# Altium project Apollo_Main_board.PrjPcb
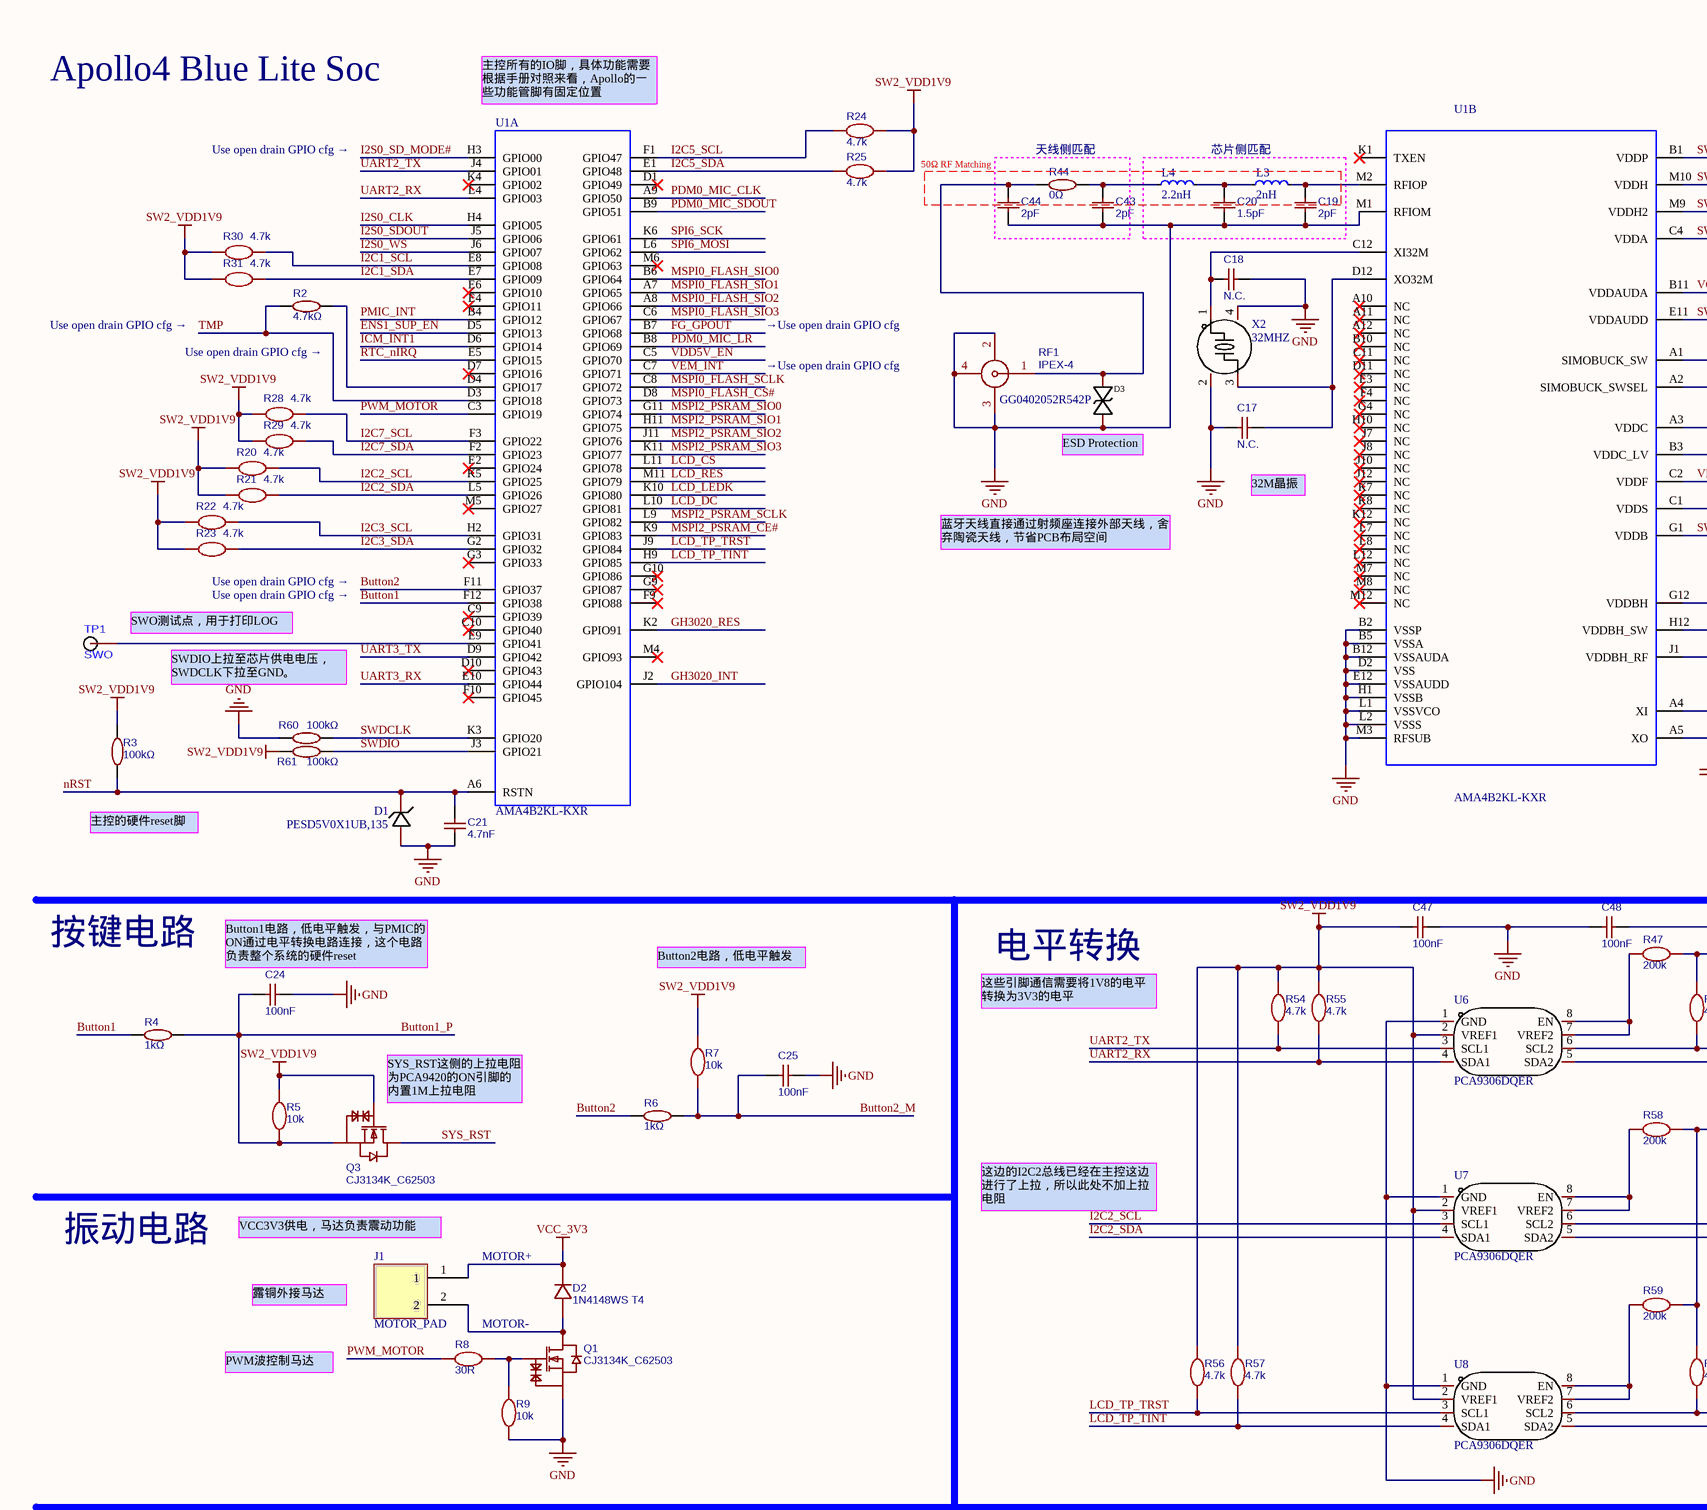
[diagram p0: Apollo_Main_Board.SchDoc, top left]
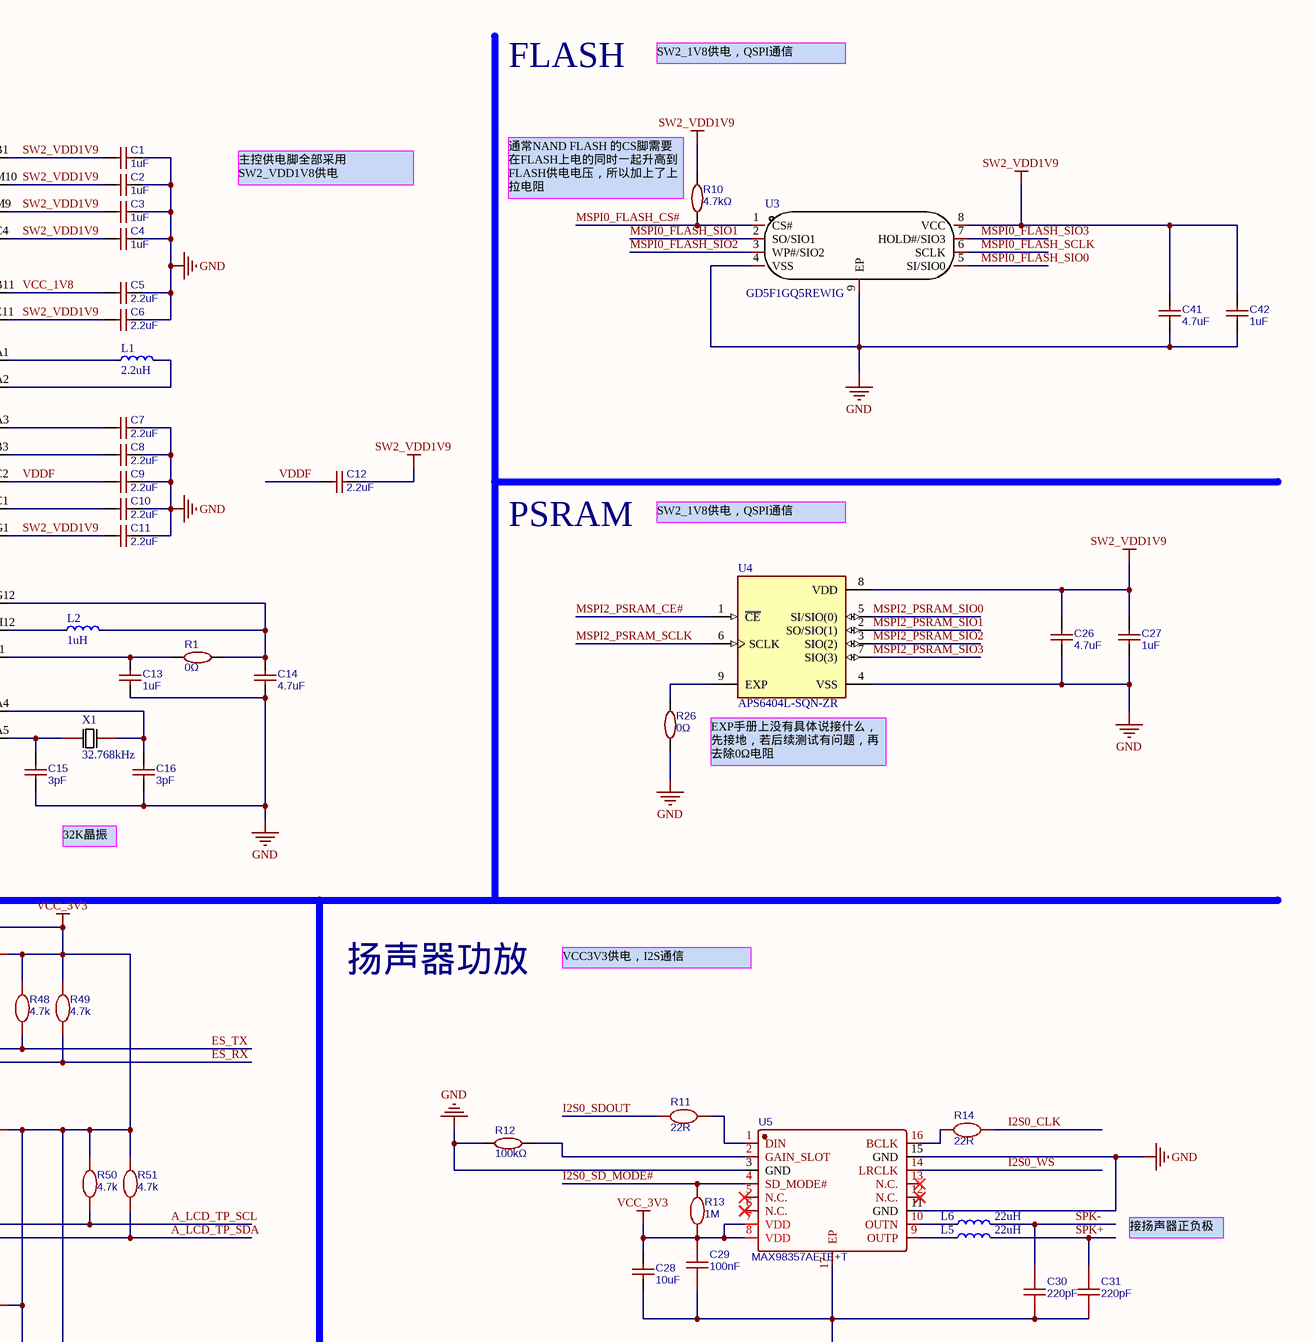
[diagram p1: Apollo_Main_Board.SchDoc, top right]
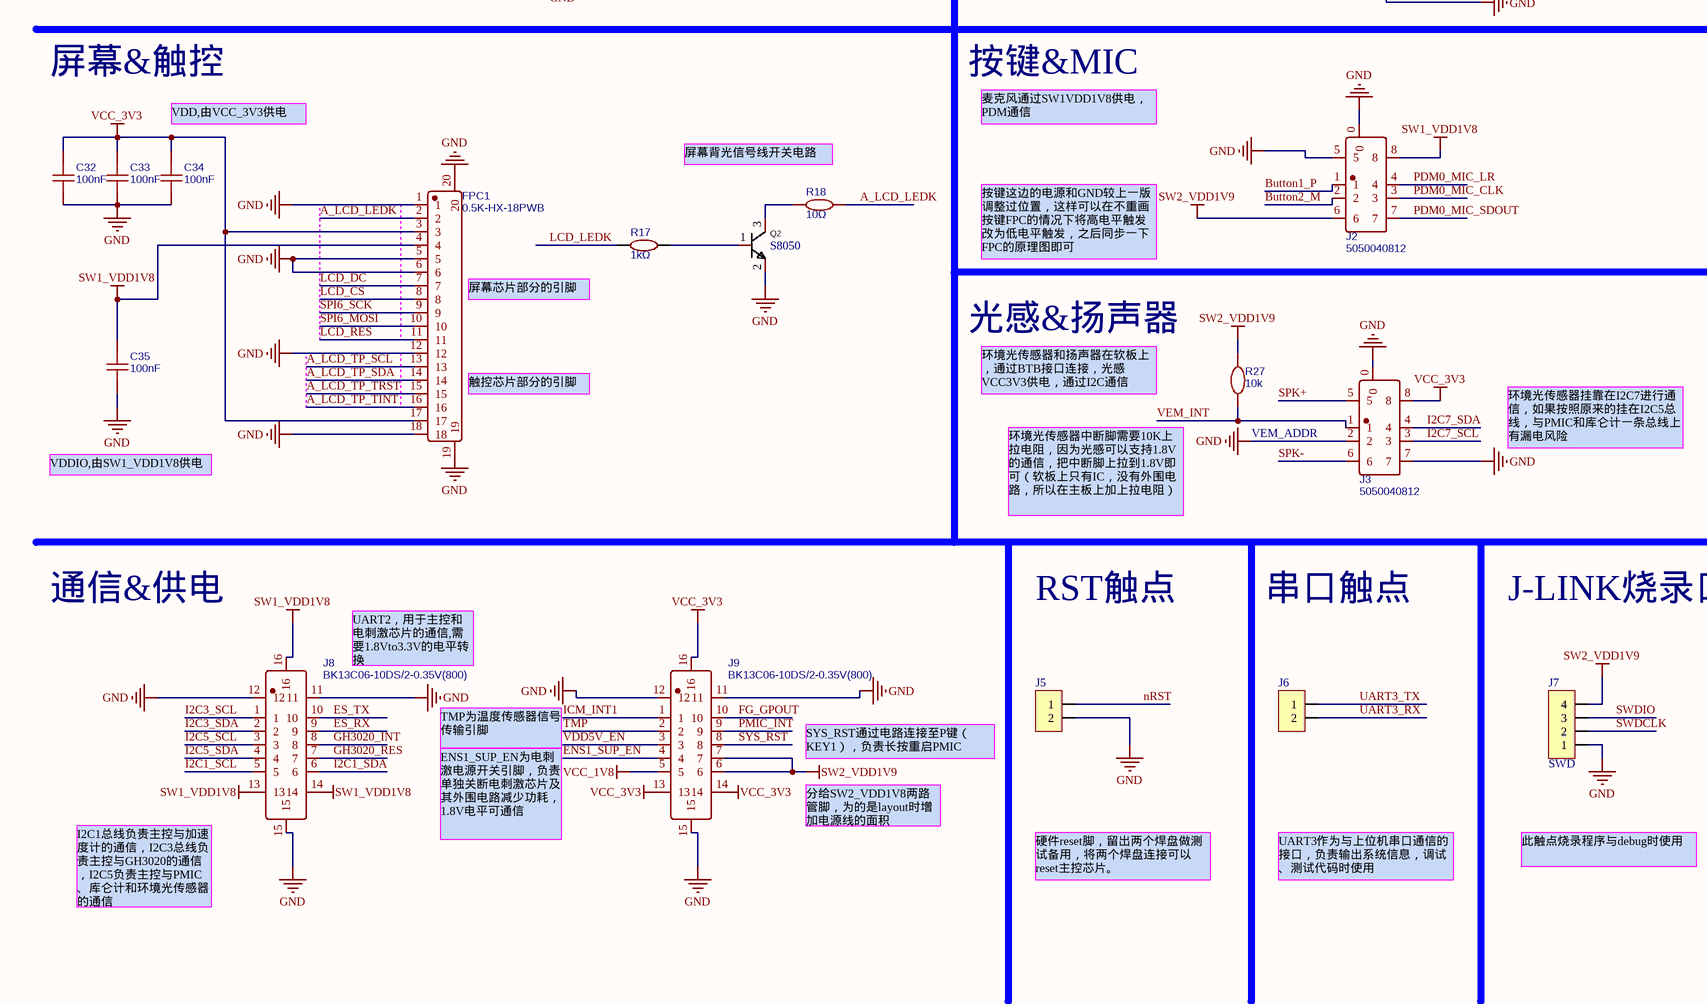
[diagram p2: Apollo_Main_Board.SchDoc, bottom left]
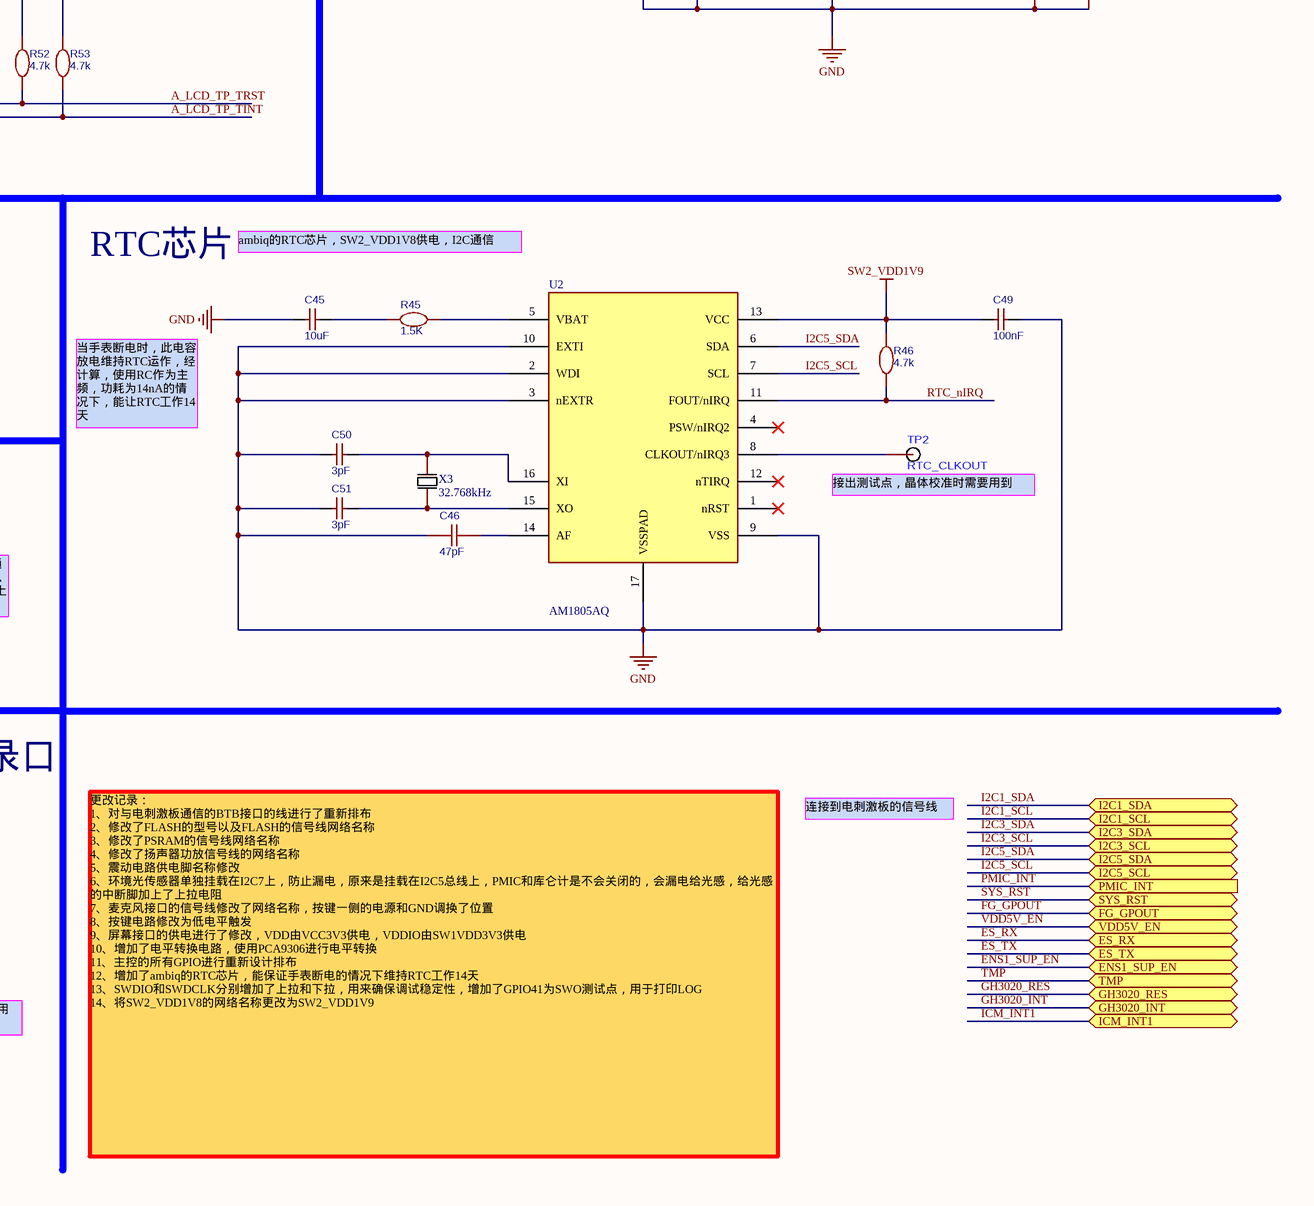
[diagram p3: Apollo_Main_Board.SchDoc, bottom right]
1 sheet, 125 parts. Net scope: flat (ports and power ports of the same name join across sheets).
Board files: Apollo_Main_Board_1 8.PcbDoc, Apollo_Main_Board_exercise.PcbDoc

## Sheet Apollo_Main_Board.SchDoc
size 558 x 469 mm; SheetNumber: 1; SheetTotal: 1

### Parts
C1  1uF  [C0201]
C2  1uF  [C0201]
C3  1uF  [C0201]
C4  1uF  [C0201]
C5  2.2uF  [C0201]
C6  2.2uF  [C0201]
C7  2.2uF  [C0201]
C8  2.2uF  [C0201]
C9  2.2uF  [C0201]
C10  2.2uF  [C0201]
C11  2.2uF  [C0201]
C12  2.2uF  [C0201]
C13  1uF  [C0201]
C14  4.7uF  [C0201]
C15  3pF  [C0201]
C16  3pF  [C0201]
C17  N.C.  [C0201]
C18  N.C.  [C0201]
C19  2pF  [C0201]
C20  1.5pF  [C0201]
C21  4.7nF  [C0201]
C24  100nF  [C0201]
C25  100nF  [C0201]
C26  4.7uF  [C0201]
C27  1uF  [C0201]
C28  10uF  [C0402]
C29  100nF  [C0201]
C30  220pF  [C0201]
C31  220pF  [C0201]
C32  100nF  [C0201]
C33  100nF  [C0201]
C34  100nF  [C0201]
C35  100nF  [C0201]
C41  4.7uF  [C0201]
C42  1uF  [C0201]
C43  2pF  [C0201]
C44  2pF  [C0201]
C45  10uF  [C0402]
C46  47pF  [C0201]
C47  100nF  [C0201]
C48  100nF  [C0201]
C49  100nF  [C0201]
C50  3pF  [C0201]
C51  3pF  [C0201]
D1  PESD5V0X1UB,135  [SOD-523_L1.2-W0.8-LS1.6-RD]
D2  1N4148WS T4  [SOD-323_L1.8-W1.3-LS2.5-RD]
D3  GG0402052R542P  [0402]
FPC1  0.5K-HX-18PWB  [FPC-SMD_18P-P0.50_HDGC_0.5K-HX-18PWB]
J1  MOTOR_PAD  [MOTOR_PAD]
J2  5050040812  [CONN-SMD_4P-P0.40_5050040812]
J3  5050040812  [CONN-SMD_4P-P0.40_5050040812]
J5  (no value)  [2PIN_1.27mm]
J6  (no value)  [2PIN_1.27mm]
J7  SWD  [4PIN_1.27mm]
J8  BK13C06-10DS/2-0.35V(800)  [CONN-SMD_BK13C06-10DS-2-0.35V-800]
J9  BK13C06-10DS/2-0.35V(800)  [CONN-SMD_BK13C06-10DS-2-0.35V-800]
L1  2.2uH  [C0603]
L2  1uH  [C0603]
L3  2nH  [C0201]
L4  2.2nH  [C0201]
L5  22uH  [0603A]
L6  22uH  [0603A]
Q1  CJ3134K_C62503  [SOT-723_L1.2-W0.8-P0.40-LS1.2-BR]
Q2  S8050  [SOT-23]
Q3  CJ3134K_C62503  [SOT-723_L1.2-W0.8-P0.40-LS1.2-BR]
R1  0Ω  [RES0201]
R2  4.7kΩ  [RES0201]
R3  100kΩ  [RES0201]
R4  1kΩ  [RES0201]
R5  10k  [RES0201]
R6  1kΩ  [RES0201]
R7  10k  [RES0201]
R8  30R  [RES0201]
R9  10k  [RES0201]
R10  4.7kΩ  [RES0201]
R11  22R  [RES0201]
R12  100kΩ  [RES0201]
R13  1M  [RES0201]
R14  22R  [RES0201]
R17  1kΩ  [RES0201]
R18  10Ω  [RES0201]
R20  4.7k  [RES0201]
R21  4.7k  [RES0201]
R22  4.7k  [RES0201]
R23  4.7k  [RES0201]
R24  4.7k  [RES0201]
R25  4.7k  [RES0201]
R26  0Ω  [RES0201]
R27  10k  [RES0201]
R28  4.7k  [RES0201]
R29  4.7k  [RES0201]
R30  4.7k  [RES0201]
R31  4.7k  [RES0201]
R44  0Ω  [RES0201]
R45  1.5K  [RES0201]
R46  4.7k  [RES0201]
R47  200k  [RES0201]
R48  4.7k  [RES0201]
R49  4.7k  [RES0201]
R50  4.7k  [RES0201]
R51  4.7k  [RES0201]
R52  4.7k  [RES0201]
R53  4.7k  [RES0201]
R54  4.7k  [RES0201]
R55  4.7k  [RES0201]
R56  4.7k  [RES0201]
R57  4.7k  [RES0201]
R58  200k  [RES0201]
R59  200k  [RES0201]
R60  100kΩ  [RES0201]
R61  100kΩ  [RES0201]
RF1  IPEX-4  [IPEX-SMD_4P-L1.8-W1.7-LS2.0]
TP1  SWO  [Testpoint]
TP2  RTC_CLKOUT  [Testpoint]
U1  AMA4B2KL-KXR  [BGA131_0P35_4P7x4P7_AP4BL]  (parts A,B of 2)
U2  AM1805AQ  [QFN50P300X300X90-17N]
U3  GD5F1GQ5REWIG  [WSON-8_L6.0-W5.0-P1.27-BL-EP]
U4  APS6404L-SQN-ZR  [PSON50P200X300X50-9N]
U5  MAX98357AETE+T  [TQFN-16_L3.0-W3.0-P0.50-BL-EP1.5]
U6  PCA9306DQER  [X2SON-8_L1.4-W1.0-P0.35-BL]
U7  PCA9306DQER  [X2SON-8_L1.4-W1.0-P0.35-BL]
U8  PCA9306DQER  [X2SON-8_L1.4-W1.0-P0.35-BL]
X1  32.768kHz  [OSC-SMD_2P-L1.6-W1.0]
X2  32MHZ  [CRYSTAL-SMD_4P-L1.6-W1.2-BL]
X3  32.768kHz  [OSC-SMD_2P-L1.6-W1.0]

### Blocks framed on the sheet
天线侧匹配: C43 C44 R44
芯片侧匹配: C19 C20 L3 L4

### Ports
ENS1_SUP_EN (bidir), ES_RX (bidir), ES_TX (bidir), FG_GPOUT (bidir), GH3020_INT (bidir), GH3020_RES (bidir), I2C1_SCL (bidir), I2C1_SDA (bidir), I2C3_SCL (bidir), I2C3_SDA (bidir), I2C5_SCL (bidir), I2C5_SDA (bidir), ICM_INT1 (bidir), PMIC_INT (in), SYS_RST (bidir), TMP (bidir), VDD5V_EN (bidir)

### Nets
GND: C1.1 C2.1 C3.1 C4.1 C5.1 C6.1 C7.1 C8.1 C9.1 C10.1 C11.1 C13.2 C14.2 C15.2 C16.2 C17.1 C18.2 C19.2 C20.2 C21.2 C24.2 C25.2 C26.2 C27.2 C28.2 C29.2 C30.1 C31.1 C32.2 C33.2 C34.2 C35.2 C41.2 C42.2 C43.2 C44.2 C45.2 C46.2 C47.1 C48.1 C49.2 C50.2 C51.2 D1.2(A) D3.1 FPC1.1 FPC1.5 FPC1.6 FPC1.12 FPC1.18 FPC1.19 FPC1.20 J2.0 J2.5 J3.0 J3.2 J3.7 J5.2 J7.1 J8.11 J8.12 J8.15 J9.11 J9.12 J9.15 Q1.2(S) Q2.2(E) R9.2 R12.2 R26.1 R60.2 RF1.2 RF1.3 RF1.4 U1.B2(VSSP) U1.B5(VSSA) U1.B12(VSSAUDA) U1.D2(VSS) U1.E12(VSSAUDD) U1.H1(VSSB) U1.L1(VSSVCO) U1.L2(VSSS) U1.M1(RFIOM) U1.M3(RFSUB) U2.2(WDI) U2.3(nEXTR) U2.9(VSS) U2.10(EXTI) U2.17(VSSPAD) U3.4(VSS) U3.9(EP) U4.4(VSS) U5.3(GND) U5.11(GND) U5.15(GND) U5.17(EP) U6.1(GND) U7.1(GND) U8.1(GND) X2.2(GND) X2.4(GND)
SW1_VDD1V8: C35.1 FPC1.4 J2.8 J8.13 J8.14 J8.16
SW2_VDD1V9: C1.2 C2.2 C3.2 C4.2 C6.2 C11.2 C12.1 C26.1 C27.1 C41.1 C42.1 C47.2 C49.1 J2.6 J7.4 J9.6 J9.7 Q3.1(G) R3.2 R5.1 R7.1 R10.2 R20.2 R21.2 R22.2 R23.2 R24.2 R25.2 R27.1 R28.2 R29.2 R30.2 R31.2 R46.2 R54.1 R55.1 R56.1 R57.1 R61.1 U1.B1(VDDP) U1.C4(VDDA) U1.E11(VDDAUDD) U1.G1(VDDB) U1.M9(VDDH2) U1.M10(VDDH) U2.13(VCC) U3.8(VCC) U4.8(VDD) U6.2(VREF1) U7.2(VREF1) U8.2(VREF1)
VCC_1V8: C5.2 J9.5 U1.B11(VDDAUDA)
VCC_3V3: C28.1 C29.1 C32.1 C33.1 C34.1 C48.2 D2.1(K) FPC1.3 FPC1.17 J1.1 J3.8 J9.13 J9.14 J9.16 R13.2 R47.2 R48.1 R49.1 R50.1 R51.1 R52.1 R53.1 R58.2 R59.2 U5.7(VDD) U5.8(VDD)
A_LCD_LEDK: FPC1.2 R18.2
A_LCD_TP_SCL: FPC1.13 R50.2 U7.6(SCL2)
A_LCD_TP_SDA: FPC1.14 R51.2 U7.5(SDA2)
A_LCD_TP_TINT: FPC1.16 R53.2 U8.5(SDA2)
A_LCD_TP_TRST: FPC1.15 R52.2 U8.6(SCL2)
Button1: R4.1 U1.F12(GPIO38)
Button1_P: C24.1 J2.1 Q3.2(S) R4.2 R5.2
Button2: R6.1 U1.F11(GPIO37)
Button2_M: C25.1 J2.2 R6.2 R7.2
ENS1_SUP_EN: J9.4 U1.D5(GPIO13) ; port ENS1_SUP_EN
ES_RX: J8.9 R49.2 U6.5(SDA2) ; port ES_RX
ES_TX: J8.10 R48.2 U6.6(SCL2) ; port ES_TX
FG_GPOUT: J9.10 U1.B7(GPIO68) ; port FG_GPOUT
GH3020_INT: J8.8 U1.J2(GPIO104) ; port GH3020_INT
GH3020_RES: J8.7 U1.K2(GPIO91) ; port GH3020_RES
I2C1_SCL: J8.5 R30.1 U1.E8(GPIO08) ; port I2C1_SCL
I2C1_SDA: J8.6 R31.1 U1.E7(GPIO09) ; port I2C1_SDA
I2C2_SCL: R20.1 U1.K5(GPIO25) U7.3(SCL1)
I2C2_SDA: R21.1 U1.L5(GPIO26) U7.4(SDA1)
I2C3_SCL: J8.1 R22.1 U1.H2(GPIO31) ; port I2C3_SCL
I2C3_SDA: J8.2 R23.1 U1.G2(GPIO32) ; port I2C3_SDA
I2C5_SCL: J8.3 R24.1 U1.F1(GPIO47) U2.7(SCL) ; port I2C5_SCL
I2C5_SDA: J8.4 R25.1 U1.E1(GPIO48) U2.6(SDA) ; port I2C5_SDA
I2C7_SCL: J3.3 R28.1 U1.F3(GPIO22)
I2C7_SDA: J3.4 R29.1 U1.F2(GPIO23)
I2S0_CLK: R14.1 U1.H4(GPIO05)
I2S0_SD_MODE#: R13.1 U1.H3(GPIO00) U5.4(SD_MODE#)
I2S0_SDOUT: R11.2 U1.J5(GPIO06)
I2S0_WS: U1.J6(GPIO07) U5.14(LRCLK)
ICM_INT1: J9.1 U1.D6(GPIO14) ; port ICM_INT1
LCD_CS: FPC1.8 U1.L11(GPIO78)
LCD_DC: FPC1.7 U1.L10(GPIO81)
LCD_LEDK: R17.1 U1.K10(GPIO80)
LCD_RES: FPC1.11 U1.M11(GPIO79)
LCD_TP_TINT: R57.2 U1.H9(GPIO85) U8.4(SDA1)
LCD_TP_TRST: R56.2 U1.J9(GPIO84) U8.3(SCL1)
MSPI0_FLASH_CS#: R10.1 U1.D8(GPIO73) U3.1(CS#)
MSPI0_FLASH_SCLK: U1.C8(GPIO72) U3.6(SCLK)
MSPI0_FLASH_SIO0: U1.B6(GPIO64) U3.5(SI/SIO0)
MSPI0_FLASH_SIO1: U1.A7(GPIO65) U3.2(SO/SIO1)
MSPI0_FLASH_SIO2: U1.A8(GPIO66) U3.3(WP#/SIO2)
MSPI0_FLASH_SIO3: U1.C6(GPIO67) U3.7(HOLD#/SIO3)
MSPI2_PSRAM_CE#: U1.K9(GPIO83) U4.1(~{CE})
MSPI2_PSRAM_SCLK: U1.L9(GPIO82) U4.6(SCLK)
MSPI2_PSRAM_SIO0: U1.G11(GPIO74) U4.5(SI/SIO(0))
MSPI2_PSRAM_SIO1: U1.H11(GPIO75) U4.2(SO/SIO(1))
MSPI2_PSRAM_SIO2: U1.J11(GPIO76) U4.3(SIO(2))
MSPI2_PSRAM_SIO3: U1.K11(GPIO77) U4.7(SIO(3))
nRST: C21.1 D1.1(C) J5.1 R3.1 U1.A6(RSTN)
PDM0_MIC_CLK: J2.3 U1.A9(GPIO50)
PDM0_MIC_LR: J2.4 U1.B8(GPIO69)
PDM0_MIC_SDOUT: J2.7 U1.B9(GPIO51)
PMIC_INT: J9.9 U1.B4(GPIO12) ; port PMIC_INT
PWM_MOTOR: R8.2 U1.C3(GPIO19)
RTC_nIRQ: R46.1 U1.E5(GPIO15) U2.11(FOUT/nIRQ)
SPI6_MOSI: FPC1.10 U1.L6(GPIO62)
SPI6_SCK: FPC1.9 U1.K6(GPIO61)
SPK+: C31.2 J3.5 L5.2
SPK-: C30.2 J3.6 L6.2
SWDCLK: J7.2 R60.1 U1.K3(GPIO20)
SWDIO: J7.3 R61.2 U1.J3(GPIO21)
SYS_RST: J9.8 Q3.3(D) ; port SYS_RST
TMP: J9.2 R2.1 U1.D3(GPIO18) ; port TMP
UART2_RX: R55.2 U1.L4(GPIO03) U6.4(SDA1)
UART2_TX: R54.2 U1.J4(GPIO01) U6.3(SCL1)
UART3_RX: J6.2 U1.E10(GPIO44)
UART3_TX: J6.1 U1.D9(GPIO42)
VDD5V_EN: J9.3 U1.C5(GPIO70) ; port VDD5V_EN
VDDF: C9.2 C12.2 U1.C2(VDDF)
VEM_INT: J3.1 R27.2 U1.C7(GPIO71)
NetC7_2: C7.2 U1.A3(VDDC)
NetC8_2: C8.2 U1.B3(VDDC_LV)
NetC10_2: C10.2 U1.C1(VDDS)
NetC13_1: C13.1 R1.1 U1.J1(VDDBH_RF)
NetC14_1: C14.1 L2.2 R1.2 U1.G12(VDDBH)
NetC15_1: C15.1 U1.A5(XO) X1.1(OSC1)
NetC16_1: C16.1 U1.A4(XI) X1.2(OSC2)
NetC17_2: C17.2 U1.D12(XO32M) X2.3
NetC18_1: C18.1 U1.C12(XI32M) X2.1
NetC19_1: C19.1 L3.2 U1.M2(RFIOP)
NetC20_1: C20.1 L3.1 L4.2
NetC43_1: C43.1 L4.1 R44.2
NetC44_1: C44.1 D3.2 R44.1 RF1.1
NetC45_1: C45.1 R45.2
NetC46_1: C46.1 U2.14(AF)
NetC50_1: C50.1 U2.16(XI) X3.2(OSC2)
NetC51_1: C51.1 U2.15(XO) X3.1(OSC1)
NetD2_2: D2.2(A) J1.2 Q1.3(D)
NetL1_1: L1.1 U1.A1(SIMOBUCK_SW)
NetL1_2: L1.2 U1.A2(SIMOBUCK_SWSEL)
NetL2_1: L2.1 U1.H12(VDDBH_SW)
NetL5_1: L5.1 U5.9(OUTP)
NetL6_1: L6.1 U5.10(OUTN)
NetQ1_1: Q1.1(G) R8.1 R9.1
NetQ2_1: Q2.1(B) R17.2
NetQ2_3: Q2.3(C) R18.1
NetR2_2: R2.2 U1.D4(GPIO17)
NetR11_1: R11.1 U5.1(DIN)
NetR12_1: R12.1 U5.2(GAIN_SLOT)
NetR14_2: R14.2 U5.16(BCLK)
NetR26_2: R26.2 U4.9(EXP)
NetR45_1: R45.1 U2.5(VBAT)
NetR47_1: R47.1 U6.7(VREF2) U6.8(EN)
NetR58_1: R58.1 U7.7(VREF2) U7.8(EN)
NetR59_1: R59.1 U8.7(VREF2) U8.8(EN)
NetTP1_1: TP1.1(text) U1.E9(GPIO41)
NetTP2_1: TP2.1(text) U2.8(CLKOUT/nIRQ3)

Not connected (* = marked no-connect by the designer): U1 A10(NC)* A11(NC)* A12(NC)* B10(NC)* C9(GPIO39)* C10(GPIO40)* C11(NC)* D1(GPIO49)* D7(GPIO16)* D10(GPIO43)* D11(NC)* E2(GPIO24)* E3(NC)* E4(GPIO11)* E6(GPIO10)* F4(NC)* F9(GPIO88)* F10(GPIO45)* G3(GPIO33)* G4(NC)* G9(GPIO87)* G10(GPIO86)* H10(NC)* J7(NC)* J8(NC)* J10(NC)* J12(NC)* K1(TXEN)* K4(GPIO02)* K7(NC)* K8(NC)* K12(NC)* L7(NC)* L8(NC)* L12(NC)* M4(GPIO93)* M5(GPIO27)* M6(GPIO63)* M7(NC)* M8(NC)* M12(NC)*; U2 1(nRST)* 4(PSW/nIRQ2)* 12(nTIRQ)*; U5 5(N.C.)* 6(N.C.)* 12(N.C.)* 13(N.C.)*

### Notes on the sheet
- Apollo4 Blue Lite Soc
- 主控所有的IO脚，具体功能需要根据手册对照来看，Apollo的一些功能管脚有固定位置
- FLASH
- SW2_1V8供电，QSPI通信
- Use open drain GPIO cfg →
- 50Ω RF Matching
- 主控供电脚全部采用SW2_VDD1V8供电
- (near R10) 通常NAND FLASH 的CS脚需要在FLASH上电的同时一起升高到FLASH供电电压，所以加上了上拉电阻
- →Use open drain GPIO cfg
- (near D3) ESD Protection
- (near C17) 32M晶振
- 蓝牙天线直接通过射频座连接外部天线，舍弃陶瓷天线，节省PCB布局空间
- PSRAM
- SWO测试点，用于打印LOG
- (near R23) Use open drain GPIO cfg →
- SWDIO上拉至芯片供电电压，SWDCLK下拉至GND。
- EXP手册上没有具体说接什么，先接地，若后续测试有问题，再去除0Ω电阻
- (near R3) 主控的硬件reset脚
- 32K晶振
- 按键电路
- (near C24) Button1电路，低电平触发，与PMIC的ON通过电平转换电路连接，这个电路负责整个系统的硬件reset
- Button2电路，低电平触发
- 电平转换
- 扬声器功放
- VCC3V3供电，I2S通信
- 这些引脚通信需要将1V8的电平转换为3V3的电平
- (near Q3) SYS_RST这侧的上拉电阻为PCA9420的ON引脚的内置1M上拉电阻
- 振动电路
- (near J1) VCC3V3供电，马达负责震动功能
- 这边的I2C2总线已经在主控这边进行了上拉，所以此处不加上拉电阻
- 接扬声器正负极
- 露铜外接马达
- MOTOR+
- PWM波控制马达
- MOTOR-
- 屏幕&触控
- 按键&MIC
- RTC芯片
- ambiq的RTC芯片，SW2_VDD1V8供电，I2C通信
- (near C34) VDD,由VCC_3V3供电
- (near R18) 屏幕背光信号线开关电路
- 麦克风通过SW1VDD1V8供电，PDM通信
- (near FPC1) 屏幕芯片部分的引脚
- 按键这边的电源和GND较上一版调整过位置，这样可以在不重画按键FPC的情况下将高电平触发改为低电平触发，之后同步一下FPC的原理图即可
- 当手表断电时，此电容放电维持RTC运作，经计算，使用RC作为主频，功耗为14nA的情况下，能让RTC工作14天
- 光感&扬声器
- (near TP2) 接出测试点，晶体校准时需要用到
- (near FPC1) 触控芯片部分的引脚
- 环境光传感器和扬声器在软板上，通过BTB接口连接，光感VCC3V3供电，通过I2C通信
- (near R27) VEM_ADDR
- 环境光传感器挂靠在I2C7进行通信，如果按照原来的挂在I2C5总线，与PMIC和库仑计一条总线上有漏电风险
- VDDIO,由SW1_VDD1V8供电
- 环境光传感器中断脚需要10K上拉电阻，因为光感可以支持1.8V的通信，把中断脚上拉到1.8V即可（软板上只有IC，没有外围电路，所以在主板上加上拉电阻）
- 通信&供电
- RST触点
- 串口触点
- J-LINK烧录口
- 连接到电刺激板的信号线
- (near J8) UART2，用于主控和电刺激芯片的通信,需要1.8Vto3.3V的电平转换
- TMP为温度传感器信号传输引脚
- SYS_RST通过电路连接至P键（KEY1），负责长按重启PMIC
- ENS1_SUP_EN为电刺激电源开关引脚，负责单独关断电刺激芯片及其外围电路减少功耗，1.8V电平可通信
- 分给SW2_VDD1V8两路管脚，为的是layout时增加电源线的面积
- I2C1总线负责主控与加速度计的通信，I2C3总线负责主控与GH3020的通信，I2C5负责主控与PMIC、库仑计和环境光传感器的通信
- 硬件reset脚，留出两个焊盘做测试备用，将两个焊盘连接可以reset主控芯片。
- UART3作为与上位机串口通信的接口，负责输出系统信息，调试、测试代码时使用
- 此触点烧录程序与debug时使用
- 更改记录：
  1、对与电刺激板通信的BTB接口的线进行了重新排布
  2、修改了FLASH的型号以及FLASH的信号线网络名称
  3、修改了PSRAM的信号线网络名称
  4、修改了扬声器功放信号线的网络名称
  5、震动电路供电脚名称修改
  6、环境光传感器单独挂载在I2C7上，防止漏电，原来是挂载在I2C5总线上，PMIC和库仑计是不会关闭的，会漏电给光感，给光感的中断脚加上了上拉电阻
  7、麦克风接口的信号线修改了网络名称，按键一侧的电源和GND调换了位置
  8、按键电路修改为低电平触发
  9、屏幕接口的供电进行了修改，VDD由VCC3V3供电，VDDIO由SW1VDD3V3供电
  10、增加了电平转换电路，使用PCA9306进行电平转换
  11、主控的所有GPIO进行重新设计排布
  12、增加了ambiq的RTC芯片，能保证手表断电的情况下维持RTC工作14天
  13、SWDIO和SWDCLK分别增加了上拉和下拉，用来确保调试稳定性，增加了GPIO41为SWO测试点，用于打印LOG
  14、将SW2_VDD1V8的网络名称更改为SW2_VDD1V9

### Library data of the parts
C1-C4 C13 C27 C42 = 1uF: GRM033R61A105ME44D / 精度: ±20% / 额定电压: 10V / 材质(温度系数): X5R; BOM_Manufacturer Part: CL10A105KB8NNNC; BOM_Manufacturer: SAMSUNG(三星); nameAlias: Capacitance; BOM_Supplier: LCSC; BOM_Supplier Part: C15849; BOM_JLCPCB Part Class: Basic Part; spicePre: C; spiceSymbolName: CL10A105KB8NNNC
C5-C12 = 1uF: GRM033R61A225KE47D / 精度: ±10% / 额定电压: 10V / 材质(温度系数): X5R; BOM_Manufacturer Part: CL10A105KB8NNNC; BOM_Manufacturer: SAMSUNG(三星); nameAlias: Capacitance; BOM_Supplier: LCSC; BOM_Supplier Part: C15849; BOM_JLCPCB Part Class: Basic Part; spicePre: C; spiceSymbolName: CL10A105KB8NNNC
C14 C26 C41 = 1uF: GRM035R60J475ME15D / 精度: ±20% / 额定电压: 6.3V / 材质(温度系数): X5R; BOM_Manufacturer Part: CL10A105KB8NNNC; BOM_Manufacturer: SAMSUNG(三星); nameAlias: Capacitance; BOM_Supplier: LCSC; BOM_Supplier Part: C15849; BOM_JLCPCB Part Class: Basic Part; spicePre: C; spiceSymbolName: CL10A105KB8NNNC
C15 C16 C50 C51 = 1uF: GRM0335C1H3R0BA01D / 品牌: muRata(村田) / 封装: 0201 / 描述: ±0.1pF / 容值: 3pF / 额定电压: 50V / 材质(温度系数): C0G; BOM_Manufacturer Part: CL10A105KB8NNNC; BOM_Manufacturer: SAMSUNG(三星); nameAlias: Capacitance; BOM_Supplier: LCSC; BOM_Supplier Part: C15849; BOM_JLCPCB Part Class: Basic Part; spicePre: C; spiceSymbolName: CL10A105KB8NNNC
C17 C18 = 1uF: 现在选的32MHZ晶振内部负载电容8pF，可以不需要外部电容，所以NC，只留焊盘，不用焊接; BOM_Manufacturer Part: CL10A105KB8NNNC; BOM_Manufacturer: SAMSUNG(三星); nameAlias: Capacitance; BOM_Supplier: LCSC; BOM_Supplier Part: C15849; BOM_JLCPCB Part Class: Basic Part; spicePre: C; spiceSymbolName: CL10A105KB8NNNC
C19 C43 C44 = 1uF: GRM0335C1H2R0BA01D / 精度: ±0.1pF / 额定电压: 50V / 材质(温度系数): C0G; BOM_Manufacturer Part: CL10A105KB8NNNC; BOM_Manufacturer: SAMSUNG(三星); nameAlias: Capacitance; BOM_Supplier: LCSC; BOM_Supplier Part: C15849; BOM_JLCPCB Part Class: Basic Part; spicePre: C; spiceSymbolName: CL10A105KB8NNNC
C20 = 1uF: GRM0335C1H1R5BA01D / 精度: ±0.1pF / 额定电压: 50V / 材质(温度系数): C0G; BOM_Manufacturer Part: CL10A105KB8NNNC; BOM_Manufacturer: SAMSUNG(三星); nameAlias: Capacitance; BOM_Supplier: LCSC; BOM_Supplier Part: C15849; BOM_JLCPCB Part Class: Basic Part; spicePre: C; spiceSymbolName: CL10A105KB8NNNC
C21 = 1uF: CC0201KRX7R8BB472 / 精度: ±10% / 额定电压: 25V / 材质(温度系数): X7R; BOM_Manufacturer Part: CL10A105KB8NNNC; BOM_Manufacturer: SAMSUNG(三星); nameAlias: Capacitance; BOM_Supplier: LCSC; BOM_Supplier Part: C15849; BOM_JLCPCB Part Class: Basic Part; spicePre: C; spiceSymbolName: CL10A105KB8NNNC
C24 C25 C47-C49 = 1uF: CL03A104KO3NNNC / 精度: ±10% / 额定电压: 16V / 材质(温度系数): X5R; BOM_Manufacturer Part: CL10A105KB8NNNC; BOM_Manufacturer: SAMSUNG(三星); nameAlias: Capacitance; BOM_Supplier: LCSC; BOM_Supplier Part: C15849; BOM_JLCPCB Part Class: Basic Part; spicePre: C; spiceSymbolName: CL10A105KB8NNNC
C28 C45 = 1uF: GRM155R61A106ME11D / 精度: ±20% / 额定电压: 10V / 材质(温度系数): X5R; BOM_Manufacturer Part: CL10A105KB8NNNC; BOM_Manufacturer: SAMSUNG(三星); nameAlias: Capacitance; BOM_Supplier: LCSC; BOM_Supplier Part: C15849; BOM_JLCPCB Part Class: Basic Part; spicePre: C; spiceSymbolName: CL10A105KB8NNNC
C29 C32-C35 = 100nF: CL03A104KO3NNNC / 额定电压: 16V / 材质(温度系数): X5R; BOM_Manufacturer: SAMSUNG(三星); BOM_Manufacturer Part: CL10B104KB8NNNC; nameAlias: Capacitance; BOM_Supplier: LCSC; BOM_Supplier Part: C1591; BOM_JLCPCB Part Class: Extended Part; spicePre: C; spiceSymbolName: CL10B104KB8NNNC
C30 C31 = C0201: GRM0335C1H221JA01D / 精度: ±5% / 额定电压: 50V / 材质(温度系数): C0G; BOM_Manufacturer: SAMSUNG(三星); BOM_Manufacturer Part: CL10A225KB8NNNC; Contributor: LCSC; nameAlias: Capacitance; BOM_Supplier: LCSC; BOM_Supplier Part: C913904; BOM_JLCPCB Part Class: Extended Part; spicePre: C; spiceSymbolName: CL10A225KB8NNNC
C46 = C0201: GRM0335C1H470JA01D / 品牌: muRata(村田) / 封装: 0201 / 容值: 47pF / 精度: ±5% / 额定电压: 50V / 材质(温度系数): C0G; BOM_Manufacturer: SAMSUNG(三星); BOM_Manufacturer Part: CL10A225KB8NNNC; Contributor: LCSC; nameAlias: Capacitance; BOM_Supplier: LCSC; BOM_Supplier Part: C913904; BOM_JLCPCB Part Class: Extended Part; spicePre: C; spiceSymbolName: CL10A225KB8NNNC
D1 = PESD5V0X1UB,135: Manufacturer: Nexperia(安世); Add into BOM: yes; Reverse Stand-Off Voltage (Vrwm): 5V@Max; Maximum Clamping Voltage: 8V@Typ; Peak Pulse Current (Ipp)@10/1000us: 1.5A@8/20us; Breakdown Voltage: 5.8V; Type: TVS; Symbol: PESD5V0X1UB,135; Device: PESD5V0X1UB,135; LCSC Part Name: PESD5V0X1UB,135; Supplier Part: C89285; Manufacturer Part: PESD5V0X1UB,135; Supplier Footprint: SOD-523; Datasheet: https://atta.szlcsc.com/upload/public/pdf/source/20180126/C89285_15169562606211309459.pdf; Supplier: LCSC; Convert to PCB: yes; Peak Pulse Power Dissipation (Ppp)@10/1000us: -; Reverse Leakage Current (Ir): -; Name: PESD5V0X1UB,135
D2 = 1N4148WS T4: Manufacturer: CJ(江苏长电/长晶); Supplier: LCSC; Manufacturer Part: 1N4148WS; Supplier Part: C2128; JLCPCB Part Class: Basic Part; spicePre: D; spiceSymbolName: 1N4148WS T4
D3 = GG0402052R542P: GG0402052R542P / 品牌: Kyocera AVX / 封装: 0402 / 反向截止电压(Vrwm): 5V / 最大钳位电压: 15.5V / 峰值脉冲电流(Ipp): 3A@8/20us / 峰值脉冲功率(Ppp): 46W; Add into BOM: yes; Breakdown Voltage (Min): 5.5V; Name: GG0402052R542P; Symbol: GG0402052R542P; Device: GG0402052R542P; LCSC Part Name: Vrwm:5V 46W; Supplier Part: C1973257; Manufacturer: Kyocera AVX; Manufacturer Part: GG0402052R542P; Supplier Footprint: 0402; JLCPCB Part Class: Extended Part; Datasheet: https://atta.szlcsc.comnull; Supplier: LCSC; Convert to PCB: yes; Reverse Stand-Off Voltage (Vrwm): 5V; Peak Pulse Current (Ipp)@10/1000μs: 3A@8/20us; Maximum Clamping Voltage: 15.5V; Peak Pulse Power Dissipation (Ppp)@10/1000μs: 46W
FPC1 = 0.5K-HX-18PWB: BOM_Manufacturer: HDGC(华德共创); Contributor: LCSC; BOM_Supplier: LCSC; BOM_Supplier Part: C2919497; BOM_Manufacturer Part: 0.5K-HX-18PWB; BOM_JLCPCB Part Class: Extended Part; spicePre: F; spiceSymbolName: 0.5K-HX-18PWB
J2 J3 = 5050040812_8pin_ds: Manufacturer: MOLEX; Contributor: lcsc; Supplier: LCSC; Supplier Part: C724121; Manufacturer Part: 5050040812; JLCPCB Part Class: Extended Part; spicePre: U; spiceSymbolName: 5050040812
J5 J6 = Header 2: Header, 2-Pin, encryption interface; LatestRevisionDate: 17-Jul-2002; LatestRevisionNote: Re-released for DXP Platform.; Publisher: Altium Limited
J7 = Header 4: Header, 4-Pin; LatestRevisionDate: 17-Jul-2002; LatestRevisionNote: Re-released for DXP Platform.; Publisher: Altium Limited
J8 J9 = 10pin_ds_BK13C06-10DS/2-0.35V(800): Manufacturer: HRS(广濑); Contributor: lcsc; Supplier: LCSC; Supplier Part: C3024358; Manufacturer Part: BK13C06-10DS/2-0.35V(800); JLCPCB Part Class: Extended Part; spicePre: C; spiceSymbolName: BK13C06-10DS/2-0.35V(800)
L1 = 10uH: MAP1608ST2R2MMPK（这是按照官方推荐的选型，不要轻易变动）; Part Number: L0603-10µ; Value: 10µH; Pad Count: 2; Footprint Doc: 0603; Component Class: Inductors
L2 = 10uH: MAP1608ST1R0MMPK（这是按照官方推荐的选型，不要轻易变动）; Part Number: L0603-10µ; Value: 10µH; Pad Count: 2; Footprint Doc: 0603; Component Class: Inductors
L3 = 10uH: LQP03HQ2N0C02D / 品牌: muRata(村田) / 封装: 0201 / 描述: ±0.2nH / 电感值: 2nH / 额定电流: 600mA / 直流电阻(DCR): 120mΩ / Q值: 20@500MHz; Part Number: L0603-10µ; Value: 10µH; Pad Count: 2; Footprint Doc: 0603; Component Class: Inductors
L4 = 10uH: LQP03TN2N2B02D / 品牌: muRata(村田) / 封装: 0201 / 描述: ±0.1nH / 电感值: 2.2nH / 额定电流: 600mA / 直流电阻(DCR): 150mΩ / Q值: 14@500MHz; Part Number: L0603-10µ; Value: 10µH; Pad Count: 2; Footprint Doc: 0603; Component Class: Inductors
L5 L6 = 10uH: Chip inductor, IDC,min = 50 mA, ±20 % / MLZ1608M220WT000 / 精度: ±20% / 饱和电流(Isat): 55mA / 直流电阻(DCR): 2.4Ω; Part Number: L0603-10µ; Value: 10µH; Pad Count: 2; Footprint Doc: 0603; Component Class: Inductors
Q1 Q3 = CJ3134K_C62503: Manufacturer: CJ(江苏长电/长晶); Manufacturer Part: CJ3134K KF; Supplier: LCSC; Supplier Part: C62503; JLCPCB Part Class: Extended Part; spicePre: Q; spiceSymbolName: CJ3134K_C62503
Q2 = S8050: Manufacturer: 星海; Symbol: S8050_C2992076; Add into BOM: yes; Name: S8050; Device: S8050; LCSC Part Name: S8050; Supplier Part: C2992076; Manufacturer Part: S8050; Supplier Footprint: SOT-23; JLCPCB Part Class: Extended Part; Datasheet: https://atta.szlcsc.com/upload/public/pdf/source/20220412/23B2261F7486AF0B250D66C32D3117E2.pdf; Supplier: LCSC; Convert to PCB: yes
R1 R26 = 0Ω: RC0201FR-070RL / 品牌: YAGEO(国巨) / 封装: 0201 / 电阻类型: 厚膜电阻 / 阻值: 0Ω / 精度: ±1% / 功率: 50mW; BOM_Manufacturer: PANASONIC(松下); BOM_Manufacturer Part: ERJ3GEY0R00V; nameAlias: Resistance; Resistance (Ohms): 0; BOM_Supplier: LCSC; BOM_Supplier Part: C122704; BOM_JLCPCB Part Class: Extended Part; spicePre: R; spiceSymbolName: ERJ-3GEY0R00V
R2 R10 = 0Ω: 0201WMF4701TEE / 精度: ±1% / 功率: 50mW; BOM_Manufacturer: PANASONIC(松下); BOM_Manufacturer Part: ERJ3GEY0R00V; nameAlias: Resistance; Resistance (Ohms): 0; BOM_Supplier: LCSC; BOM_Supplier Part: C122704; BOM_JLCPCB Part Class: Extended Part; spicePre: R; spiceSymbolName: ERJ-3GEY0R00V
R3 R12 R60 R61 = 0Ω: 0201WMF1003TEE / 精度: ±1% / 功率: 50mW; BOM_Manufacturer: PANASONIC(松下); BOM_Manufacturer Part: ERJ3GEY0R00V; nameAlias: Resistance; Resistance (Ohms): 0; BOM_Supplier: LCSC; BOM_Supplier Part: C122704; BOM_JLCPCB Part Class: Extended Part; spicePre: R; spiceSymbolName: ERJ-3GEY0R00V
R4 R6 R17 = 0Ω: 0201WMF1001TEE / 精度: ±1% / 功率: 50mW; BOM_Manufacturer: PANASONIC(松下); BOM_Manufacturer Part: ERJ3GEY0R00V; nameAlias: Resistance; Resistance (Ohms): 0; BOM_Supplier: LCSC; BOM_Supplier Part: C122704; BOM_JLCPCB Part Class: Extended Part; spicePre: R; spiceSymbolName: ERJ-3GEY0R00V
R5 R7 R9 R27 = RES0201: 0201WMF1002TEE / 精度: ±1% / 功率: 50mW; BOM_Manufacturer: UNI-ROYAL(厚声); BOM_Manufacturer Part: TC0325B1000T5F; Resistance: 100Ω; Contributor: lcsc; BOM_Supplier: LCSC; BOM_Supplier Part: C2989113; link: https://atta.szlcsc.com/upload/public/pdf/source/20220708/6ACD1707201702E70C0F417A19EB926E.pdf; spicePre: U; spiceSymbolName: TC0325B1000T5F
R8 = RES0201: RC-01W30R0FT / 精度: ±1% / 功率: 50mW; BOM_Manufacturer: UNI-ROYAL(厚声); BOM_Manufacturer Part: TC0325B1000T5F; Resistance: 100Ω; Contributor: lcsc; BOM_Supplier: LCSC; BOM_Supplier Part: C2989113; link: https://atta.szlcsc.com/upload/public/pdf/source/20220708/6ACD1707201702E70C0F417A19EB926E.pdf; spicePre: U; spiceSymbolName: TC0325B1000T5F
R11 R14 = RES0201: RC0201FR-0722RL / 精度: ±1% / 功率: 50mW; BOM_Manufacturer: UNI-ROYAL(厚声); BOM_Manufacturer Part: TC0325B1000T5F; Resistance: 100Ω; Contributor: lcsc; BOM_Supplier: LCSC; BOM_Supplier Part: C2989113; link: https://atta.szlcsc.com/upload/public/pdf/source/20220708/6ACD1707201702E70C0F417A19EB926E.pdf; spicePre: U; spiceSymbolName: TC0325B1000T5F
R13 = RES0201: RC0201FR-071ML / 精度: ±1% / 功率: 50mW; BOM_Manufacturer: UNI-ROYAL(厚声); BOM_Manufacturer Part: TC0325B1000T5F; Resistance: 100Ω; Contributor: lcsc; BOM_Supplier: LCSC; BOM_Supplier Part: C2989113; link: https://atta.szlcsc.com/upload/public/pdf/source/20220708/6ACD1707201702E70C0F417A19EB926E.pdf; spicePre: U; spiceSymbolName: TC0325B1000T5F
R18 = 10Ω: FRC0201F10R0TS / 精度: ±1% / 功率: 50mW; BOM_Manufacturer: PANASONIC(松下); BOM_Manufacturer Part: ERJPA3F10R0V; Contributor: lcsc; nameAlias: Resistance; BOM_Supplier: LCSC; BOM_Supplier Part: C441910; spicePre: U; spiceSymbolName: ERJPA3F10R0V
R20-R25 R28-R31 R46 R48-R57 = RES0402: 0201WMF4701TEE / 精度: ±1% / 功率: 50mW; BOM_Manufacturer: UNI-ROYAL(厚声); BOM_Manufacturer Part: TC0325B1000T5F; Resistance: 100Ω; Contributor: lcsc; BOM_Supplier: LCSC; BOM_Supplier Part: C2989113; link: https://atta.szlcsc.com/upload/public/pdf/source/20220708/6ACD1707201702E70C0F417A19EB926E.pdf; spicePre: U; spiceSymbolName: TC0325B1000T5F
R44 = 0Ω: 0201WMF0000TEE / 精度: ±1% / 功率: 50mW; BOM_Manufacturer: PANASONIC(松下); BOM_Manufacturer Part: ERJ3GEY0R00V; nameAlias: Resistance; Resistance (Ohms): 0; BOM_Supplier: LCSC; BOM_Supplier Part: C122704; BOM_JLCPCB Part Class: Extended Part; spicePre: R; spiceSymbolName: ERJ-3GEY0R00V
R45 = RES0201: RC0201FR-071K5L / 品牌: YAGEO(国巨) / 封装: 0201 / 电阻类型: 厚膜电阻 / 阻值: 1.5kΩ / 精度: ±1% / 功率: 50mW; BOM_Manufacturer: UNI-ROYAL(厚声); BOM_Manufacturer Part: TC0325B1000T5F; Resistance: 100Ω; Contributor: lcsc; BOM_Supplier: LCSC; BOM_Supplier Part: C2989113; link: https://atta.szlcsc.com/upload/public/pdf/source/20220708/6ACD1707201702E70C0F417A19EB926E.pdf; spicePre: U; spiceSymbolName: TC0325B1000T5F
R47 R58 R59 = RES0201: RC0201FR-07200KL / 品牌: YAGEO(国巨) / 封装: 0201 / 电阻类型: 厚膜电阻 / 阻值: 200kΩ / 精度: ±1% / 功率: 50mW; BOM_Manufacturer: UNI-ROYAL(厚声); BOM_Manufacturer Part: TC0325B1000T5F; Resistance: 100Ω; Contributor: lcsc; BOM_Supplier: LCSC; BOM_Supplier Part: C2989113; link: https://atta.szlcsc.com/upload/public/pdf/source/20220708/6ACD1707201702E70C0F417A19EB926E.pdf; spicePre: U; spiceSymbolName: TC0325B1000T5F
RF1 = IPEX-4: Manufacturer: Ziisor(致哲); Contributor: lcsc; Supplier: LCSC; Supplier Part: C2987683; Manufacturer Part: IPEX-4; JLCPCB Part Class: Extended Part; spicePre: R; spiceSymbolName: IPEX-4
TP1 TP2 = TP
U1 = APOLLO4BLKXR: None; Manufacturer: AMBIQ; IC TYPE: MCU; AMBIQ PN: APOLLO4BLKXR; Manufacturer Part Number: AMA4B2KL-KXR; Category: Microcontrollers
U4 = APS6404L-3SQR-ZR: DRAM IoT RAM 64Mb QSPI (x 1,x4) SDR 144MHz, 1; MF: AP Memory; SnapEDA_Link: https://www.snapeda.com/parts/APS6404L-3SQR-ZR/Apacer+Memory+America/view-part/?ref=snap; Package: None; Value: *; MP: APS6404L-3SQR-ZR; Check_prices: https://www.snapeda.com/parts/APS6404L-3SQR-ZR/Apacer+Memory+America/view-part/?ref=eda
U5 = MAX98357AETE+T: Manufacturer: ADI(亚德诺)/MAXIM(美信); Contributor: LCSC; Supplier: LCSC; Supplier Part: C910544; Manufacturer Part: MAX98357AETE+T; JLCPCB Part Class: Extended Part; spicePre: U; spiceSymbolName: MAX98357AETE+T
U6-U8 = PCA9306DQER: Manufacturer: TI(德州仪器); Add into BOM: yes; Symbol: PCA9306DQER; Device: PCA9306DQER; LCSC Part Name: PCA9306DQER; Supplier Part: C440032; Manufacturer Part: PCA9306DQER; Supplier Footprint: X2-SON-8(0.8x1.4); Datasheet: https://www.ti.com/cn/lit/gpn/pca9306; Supplier: LCSC; Convert to PCB: yes; Applications: -; Voltage Isolation or Not: -; Isolation Technology: -; Name: PCA9306DQER
X1 X3 = 7BG03276A39: Manufacturer: EPSON(爱普生); Symbol: FC1610AN32.768KHZ12.5PF20PPM; Device: X1A0001210005; Add into BOM: yes; Crystal Type: 贴片晶振; Normal temperature Frequency Tolerance: ±20ppm; External load capacitor: 12.5pF; Equivalent Series Resistance (ESR): 90kΩ; LCSC Part Name: 32.768kHz ±20ppm 12.5pF; Supplier Part: C165064; Manufacturer Part: X1A0001210005; Supplier Footprint: SMD1610-2P; JLCPCB Part Class: 扩展库; Datasheet: https://atta.szlcsc.com/upload/public/pdf/source/20240418/EF67B293049306C574E8FFA8E3BB71B3.pdf; Supplier: LCSC; Convert to PCB: yes; Value: 32.768kHz; Operating Temperature: -40℃~+85℃; Name: 32.768kHz
X2 = 1S32000054